# EAGLE design BUZZI-45-4 (EAGLE 5.09)
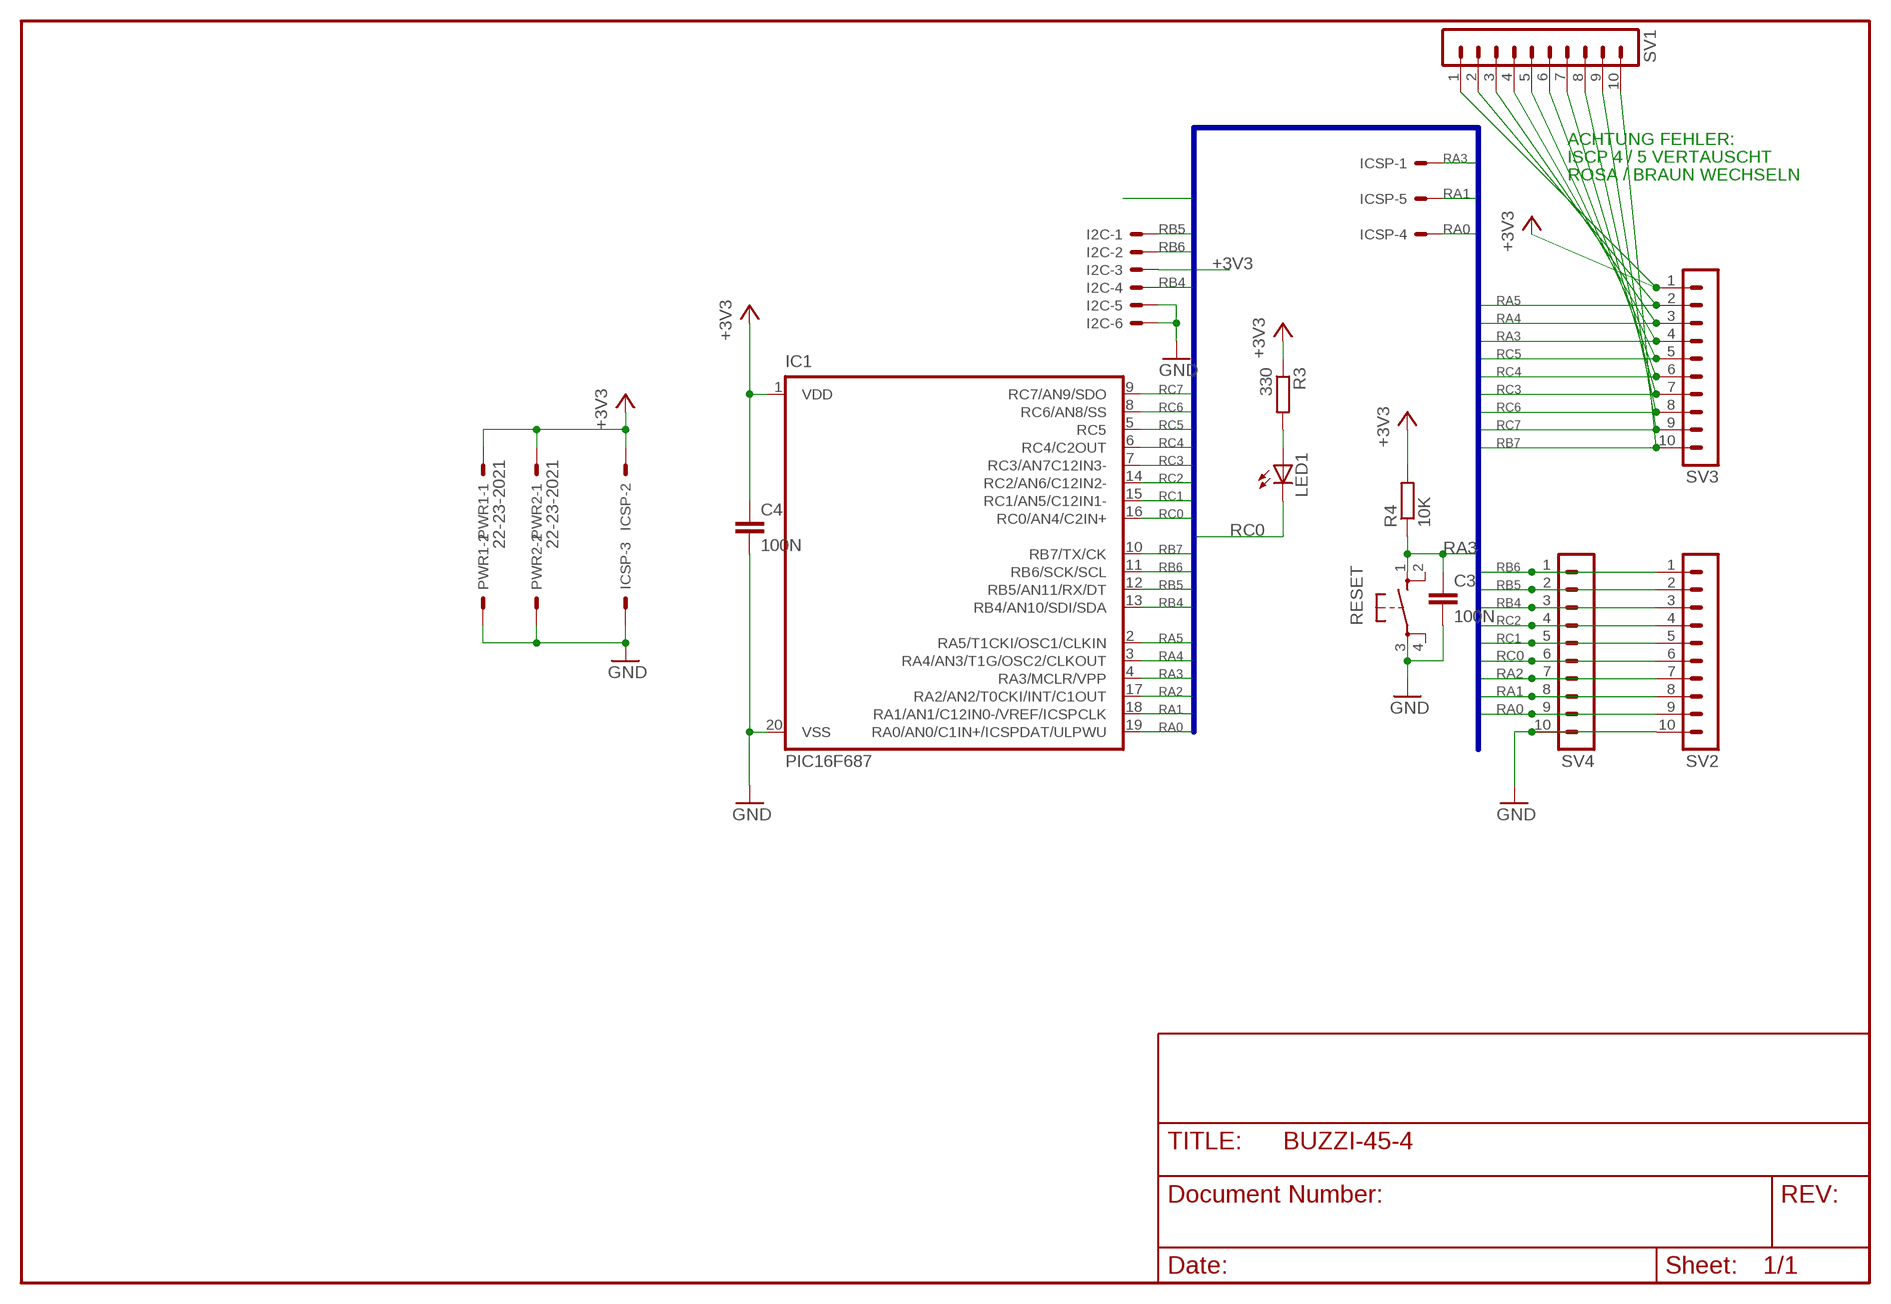
[diagram p0: schematic, sheet 1]

## Parts
C3  100N  C-EUC0805  [C0805]
C4  100N  C-EUC0805  [C0805]
I2C  22-23-2061  [22-23-2061]
IC1  PIC16F687  [SSOP20]
ICSP  22-23-2061  [22-23-2061]
LED1  LEDCHIP-LED0805  [CHIP-LED0805]
PWR1  22-23-2021  [22-23-2021]
PWR2  22-23-2021  [22-23-2021]
R3  330  R-EU_M0805  [M0805]
R4  10K  R-EU_M0805  [M0805]
RESET  10XX  [B3F-10XX]
SV1  MA10-1  [MA10-1]
SV2  MA10-1  [MA10-1]
SV3  MA10-1  [MA10-1]
SV4  MA10-1  [MA10-1]

## Nets
+3V3: C4.1 I2C.3 IC1.1(VDD) ICSP.2 PWR1.1 PWR2.1 R3.1 R4.2 SV1.1 SV3.1
GND: C3.2 C4.2 I2C.5 I2C.6 IC1.20(VSS) ICSP.3 PWR1.2 PWR2.2 RESET.3 SV2.10 SV4.10
N$1: LED1.A R3.2
RA0: IC1.19(RA0/AN0/C1IN+/ICSPDAT/ULPWU) ICSP.4 SV2.9 SV4.9
RA1: IC1.18(RA1/AN1/C12IN0-/VREF/ICSPCLK) ICSP.5 SV2.8 SV4.8
RA2: IC1.17(RA2/AN2/T0CKI/INT/C1OUT) SV2.7 SV4.7
RA3: C3.1 IC1.4(RA3/MCLR/VPP) ICSP.1 R4.1 RESET.1 SV1.4 SV3.4
RA4: IC1.3(RA4/AN3/T1G/OSC2/CLKOUT) SV1.3 SV3.3
RA5: IC1.2(RA5/T1CKI/OSC1/CLKIN) SV1.2 SV3.2
RB4: I2C.4 IC1.13(RB4/AN10/SDI/SDA) SV2.3 SV4.3
RB5: I2C.1 IC1.12(RB5/AN11/RX/DT) SV2.2 SV4.2
RB6: I2C.2 IC1.11(RB6/SCK/SCL) SV2.1 SV4.1
RB7: IC1.10(RB7/TX/CK) SV1.10 SV3.10
RC0: IC1.16(RC0/AN4/C2IN+) LED1.C SV2.6 SV4.6
RC1: IC1.15(RC1/AN5/C12IN1-) SV2.5 SV4.5
RC2: IC1.14(RC2/AN6/C12IN2-) SV2.4 SV4.4
RC3: IC1.7(RC3/AN7C12IN3-) SV1.7 SV3.7
RC4: IC1.6(RC4/C2OUT) SV1.6 SV3.6
RC5: IC1.5(RC5) SV1.5 SV3.5
RC6: IC1.8(RC6/AN8/SS) SV1.8 SV3.8
RC7: IC1.9(RC7/AN9/SDO) SV1.9 SV3.9
Unconnected: ICSP.6 RESET.2 RESET.4

## Buses
RA[0..5],RB[4..7],RC[0..7]

## Notes on the sheet
- ACHTUNG FEHLER:
- ISCP 4 / 5 VERTAUSCHT
- ROSA / BRAUN WECHSELN

## Library data of the parts
C3 C4 = turbod3:C-EU: CAPACITOR, European symbol
I2C ICSP = con-molex:22-23-2061: .100" (2.54mm) Center Header - 6 Pin
IC1 = microchip-5:PIC16F687*: MICROCONTROLLER PIC16F687 18 I/O One 16-bit timer One 8-bit timer Two comparators Precision internal oscillator-software selectable 8 MHz - 32 KHz SSP w/ I2C Compatible Address mask option EUSART LIN 2.0 Compatible 12 A/D Channels ULPW Enhanced Low Power Timer 1 Timer 1 Gate Synch Latch 2k Program Flash memory 128 bytes SRAM 256 bytes EEPROM
LED1 = led:LED: LED OSRAM: - CHIPLED LG R971, LG N971, LY N971, LG Q971, LY Q971, LO R971, LY R971 LH N974, LH R974 LS Q976, LO Q976, LY Q976 LO Q996 - Hyper CHIPLED LW Q18S LB Q993, LB Q99A, LB R99A - SideLED LS A670, LO A670, LY A670, LG A670, LP A670 LB A673, LV A673, LT A673, LW A673 LH A674 LY A675 LS A676, LA A676, LO A676, LY A676, LW A676 LS A679, LY A679, LG A679 - Hyper Micro SIDELED® LS Y876, LA Y876, LO Y876, LY Y876 LT Y87S - SmartLED LW L88C, LW L88S LB L89C, LB L89S, LG L890 LS L89K, LO L89K, LY L89K LS L896, LA L896, LO L896, LY L896 - TOPLED LS T670, LO T670, LY T670, LG T670, LP T670 LSG T670, LSP T670, LSY T670, LOP T670, LYG T670 LG T671, LOG T671, LSG T671 LB T673, LV T673, LT T673, LW T673 LH T674 LS T676, LA T676, LO T676, LY T676, LB T676, LH T676, LSB T676, LW T676 LB T67C, LV T67C, LT T67C, LS T67K, LO T67K, LY T67K, LW E67C LS E67B, LA E67B, LO E67B, LY E67B, LB E67C, LV E67C, LT E67C LW T67C LS T679, LY T679, LG T679 LS T770, LO T770, LY T770, LG T770, LP T770 LB T773, LV T773, LT T773, LW T773 LH T774 LS E675, LA E675, LY E675, LS T675 LS T776, LA T776, LO T776, LY T776, LB T776 LHGB T686 LT T68C, LB T68C - Hyper Mini TOPLED® LB M676 - Mini TOPLED Santana® LG M470 LS M47K, LO M47K, LY M47K Source: http://www.osram.convergy.de/
PWR1 PWR2 = con-molex:22-23-2021: .100" (2.54mm) Center Header - 2 Pin
R3 R4 = turbod3:R-EU_: RESISTOR, European symbol
RESET = KEY_B:10XX
SV1-SV4 = con-lstb:MA10-1: PIN HEADER

## Board
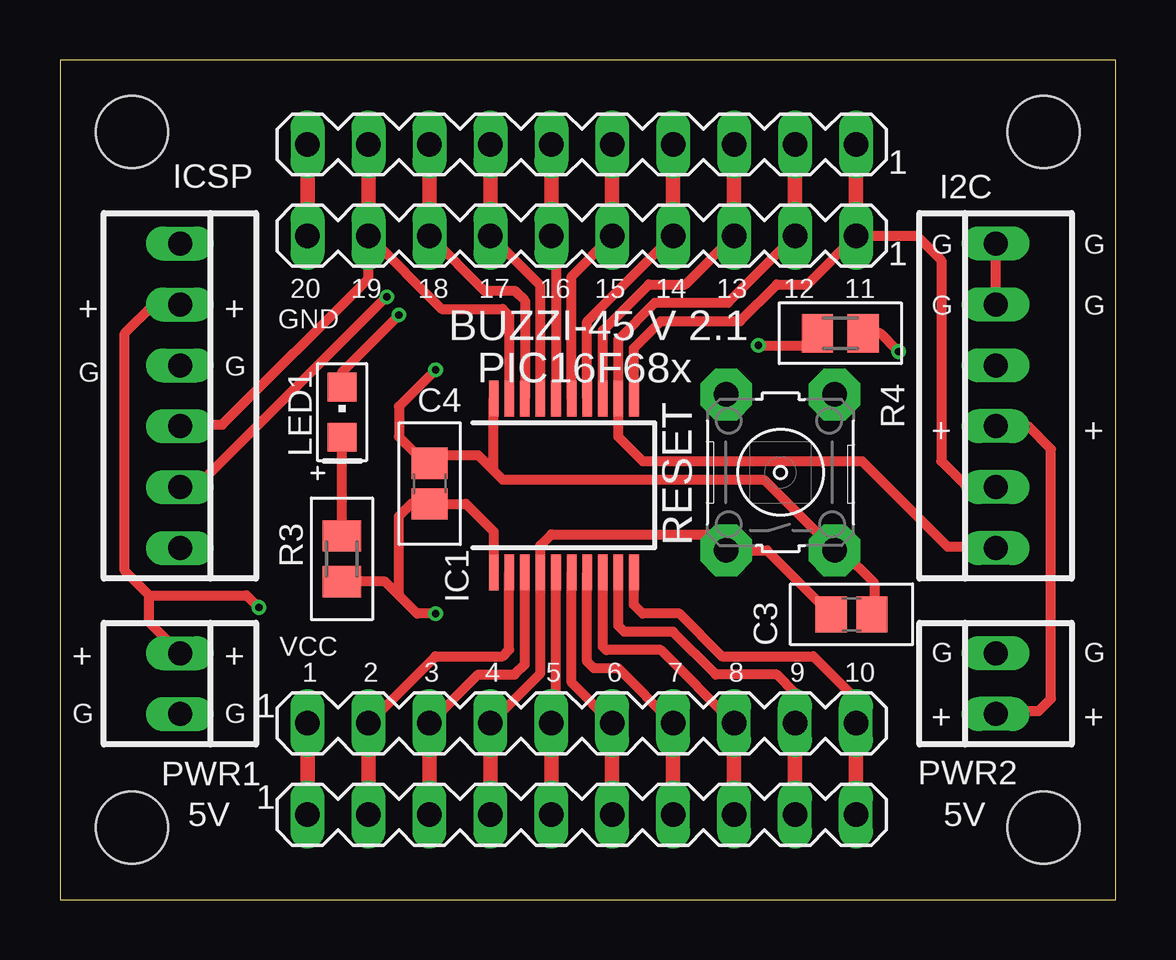
[diagram p1: board, top side]
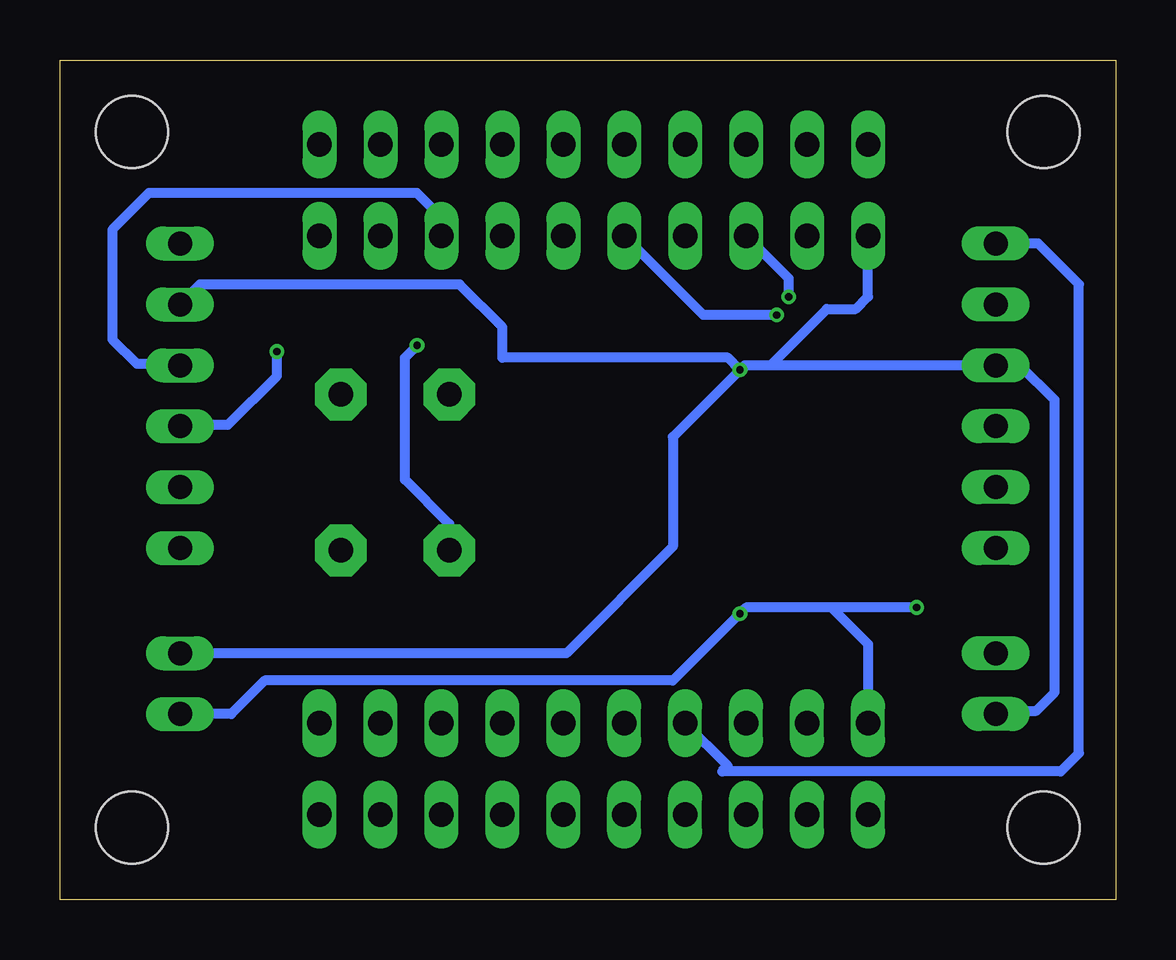
[diagram p2: board, bottom side, seen from below]

Size 44 x 35 mm. Coordinates in mm from the lower left corner, seen from the top.
Outline: 0,0 44,0 44,35 0,35 0,0
Copper layers (1*16): Top 0.035mm / dielectric 1.5mm / Bottom 0.035mm
Design rules "PCB-POOL": minimum track width 6mil, minimum drill 12mil, track to track 6mil, track to pad 6mil, pad to pad 6mil, via to via 6mil, smd to smd 6mil, copper to edge 20mil, drill to drill 8mil, minimum pad ring 8mil, minimum via ring 6mil, stop-mask expansion 3mil, vias tented up to drill 0mil, thermal gap 8mil
Holes 3 mm at 3,32 3,3 41,32 41,3

### Footprints (pad centres in the part's own frame; a part is rotated, then mirrored left to right if it is on the bottom)
C0805 = smd 1.3 x 1.5: 1 -0.85,0; 2 0.85,0
22-23-2061 = drill 1 long: 1 -6.35,0; 2 -3.81,0; 3 -1.27,0; 4 1.27,0; 5 3.81,0; 6 6.35,0
SSOP20 = smd 0.4 x 1.5: 1 -2.925,-3.625; 2 -2.275,-3.625; 3 -1.625,-3.625; 4 -0.975,-3.625; 5 -0.325,-3.625; 6 0.325,-3.625; 7 0.975,-3.625; 8 1.625,-3.625; 9 2.275,-3.625; 10 2.925,-3.625; 11 2.925,3.625; 12 2.275,3.625; 13 1.625,3.625; 14 0.975,3.625; 15 0.325,3.625; 16 -0.325,3.625; 17 -0.975,3.625; 18 -1.625,3.625; 19 -2.275,3.625; 20 -2.925,3.625
CHIP-LED0805 = smd 1.2 x 1.2: A 0,-1.05; C 0,1.05
22-23-2021 = drill 1 long: 1 -1.27,0; 2 1.27,0
M0805 = smd 1.3 x 1.6: 1 -0.95,0; 2 0.95,0
B3F-10XX = drill 1.016 pad 2.159 octagon: 1 -3.379,2.312; 2 3.123,2.312; 3 -3.379,-2.209; 4 3.123,-2.209
MA10-1 = drill 1.016 long: 1 -11.43,0; 2 -8.89,0; 3 -6.35,0; 4 -3.81,0; 5 -1.27,0; 6 1.27,0; 7 3.81,0; 8 6.35,0; 9 8.89,0; 10 11.43,0

### Placement (x,y rotation side)
C3  32.99,11.89 0 top
C4  15.41,17.34 90 top
I2C  39,21 90 top
IC1  21,17.27 0 top
ICSP  5,21 270 top
LED1  11.76,20.32 0 top
PWR1  5,9 270 top
PWR2  39,9 90 top
R3  11.76,14.2 90 top
R4  32.53,23.61 0 top
RESET  30.09,17.93 90 top
SV1  21.75,7.35 0 top
SV2  21.75,27.67 180 top
SV3  21.75,3.54 0 top
SV4  21.75,31.48 180 top

### Tracks (layer width: path | path; a pad name or v marks a point on that pad's centre or on a via)
+3V3  (via drill 0.3)
  Top 0.406: I2C.3 40.36,19.73 41.31,18.78 41.31,8.37 40.8,7.86 39.13,7.86 PWR2.1 | C4.1 15.4,16.47 | ICSP.2 3.9,24.81 2.7,23.61 2.7,13.7 3.72,12.68 | 3.72,12.68 7.78,12.68 v8.29,12.18 | v15.65,11.92 14.89,11.92 14.13,12.68 | 14.13,12.68 14.13,15.99 14.64,16.49 C4.1 | IC1.1 18.07,15.34 16.92,16.49 15.42,16.49 C4.1 | R3.1 13.56,13.25 14.13,12.68 | R4.2 34.2,23.61 v34.96,22.84 | 3.72,12.68 3.72,11.55 PWR1.1
  Top 0.61: SV1.1 SV3.1
  Bottom 0.406: PWR2.1 36.86,7.73 35.47,9.13 18.45,9.13 v15.65,11.92 15.4,12.18 11.84,12.18 | v8.29,12.18 11.84,12.18 | SV1.1 10.32,10.65 11.84,12.18 | v34.96,22.84 34.96,21.83 36.99,19.8 38.93,19.8 I2C.3
GND  (via drill 0.3)
  Top 0.406: 18.07,17.88 IC1.20 | 18.07,17.88 18.45,17.51 29.34,17.51 RESET.3 32.58,14.55 33.94,13.19 33.94,11.99 C3.2 | 38.93,24.88 I2C.5 I2C.6 | v15.65,22.08 14.13,20.56 14.13,19.29 15.23,18.19 C4.2 15.75,18.53 17.43,18.53 18.07,17.88
  Top 0.61: SV2.10 SV4.10
  Bottom 0.406: SV2.10 10.32,25.13 10.83,24.62 12.03,24.62 14.38,22.27 | v15.65,22.08 16.16,22.59 25.56,22.59 25.56,23.86 27.34,25.64 38.17,25.64 I2C.5 | PWR2.2 22.89,10.27 18.45,14.72 18.45,19.29 v15.65,22.08 | 14.38,22.27 ICSP.3 3.98,22.27 2.54,20.83 2.54,8.64 3.3,7.87 4.86,7.87 PWR1.2 | 14.38,22.27 15.47,22.27 v15.65,22.08
N$1
  Top 0.406: LED1.A R3.2
RA0
  Top 0.406: IC1.19 18.73,24.34 18.7,24.37 18.45,24.62 15.91,24.62 SV2.9 12.86,25.89 6.76,19.8 5.07,19.8 ICSP.4
  Top 0.61: SV2.9 SV4.9
RA1  (via drill 0.3)
  Top 0.406: IC1.18 19.38,24.96 18.96,25.38 17.69,25.38 SV2.8 | ICSP.5 5.68,17.19 v13.62,25.13
  Top 0.61: SV2.8 SV4.8
  Bottom 0.406: v13.62,25.13 13.62,25.89 SV2.8
RA2
  Top 0.406: IC1.17 20.02,25.59 SV2.7
  Top 0.61: SV2.7 SV4.7
RA3  (via drill 0.3)
  Top 0.406: SV1.4 20.02,9.44 IC1.4 20.02,14.77 20.48,15.22 27.11,15.22 RESET.1 29.48,14.55 C3.1 | v29.12,23.1 31.07,23.1 R4.1
  Top 0.61: SV1.4 SV3.4
  Bottom 0.406: RESET.1 27.77,15.66 29.62,17.51 29.62,22.59 v29.12,23.1 | SV1.4 16.16,5.57 16.4,5.33 2.29,5.33 1.52,6.1 1.52,25.65 3.22,27.35 ICSP.1
RA4
  Top 0.406: IC1.3 19.38,9.8 18.96,9.38 17.43,9.38 SV1.3
  Top 0.61: SV3.3 SV1.3
RA5
  Top 0.406: IC1.2 18.73,10.42 18.45,10.14 15.65,10.14 SV1.2
  Top 0.61: SV3.2 SV1.2
RB4
  Top 0.406: IC1.13 22.62,23.72 24.54,25.64 26.07,25.64 SV2.3
  Top 0.61: SV2.3 SV4.3
  Bottom 0.406: SV2.3 28.1,28.43 29.12,29.45 40.29,29.45 41.82,27.92 41.82,23.35 40.8,22.34 39.07,22.34 I2C.4
RB5
  Top 0.406: SV2.2 27.85,24.88 24.8,24.88 23.27,23.35 IC1.12 23.27,19.29 24.29,18.27 33.43,18.27 36.99,14.72 38.93,14.72 I2C.1
  Top 0.61: SV2.2 SV4.2
RB6
  Top 0.406: IC1.11 23.93,22.99 25.05,24.11 28.35,24.11 29.88,25.64 31.15,25.64 SV2.1 35.72,27.67 36.74,26.65 36.74,18.27 37.75,17.26 38.93,17.26 | 38.93,17.26 I2C.2 38.93,17.26
  Top 0.61: SV2.1 SV4.1
RB7
  Top 0.406: IC1.10 23.93,12.29 24.29,11.92 25.81,11.92 27.59,10.14 31.4,10.14 32.93,8.62 32.93,7.6 SV1.10
  Top 0.61: SV1.10 SV3.10
RC0  (via drill 0.3)
  Top 0.406: IC1.16 20.68,27.48 SV2.6 | LED1.C 11.76,22 v14.13,24.37
  Top 0.61: SV2.6 SV4.6
  Bottom 0.406: v14.13,24.37 17.18,24.37 SV2.6
RC1
  Top 0.406: IC1.15 21.32,25.98 SV2.5
  Top 0.61: SV2.5 SV4.5
RC2
  Top 0.406: IC1.14 21.98,24.09 SV2.4
  Top 0.61: SV2.4 SV4.4
RC3
  Top 0.406: IC1.7 21.98,9.92 22.26,9.64 23.27,9.64 SV1.7
  Top 0.61: SV3.7 SV1.7
RC4
  Top 0.406: IC1.6 21.32,9.04 SV1.6
  Top 0.61: SV3.6 SV1.6
RC5
  Top 0.406: IC1.5 20.68,7.54 SV1.5
  Top 0.61: SV3.5 SV1.5
RC6
  Top 0.406: IC1.8 22.62,10.54 22.77,10.4 25.05,10.4 SV1.8
  Top 0.61: SV3.8 SV1.8
RC7
  Top 0.406: IC1.9 23.27,11.41 23.53,11.16 25.56,11.16 27.34,9.38 29.88,9.38 30.64,8.62 30.64,6.84
  Top 0.61: SV3.9 30.64,6.84 SV1.9

### Text on the board
tNames: G | G | 20 | 19 | 18 | 17 | 16 | 15 | 14 | 13 | 12 | 11 | + | + | GND | G | G | BUZZI-45 V 2.1 | G | G | PIC16F68x | + | + | + | + | VCC | G | G | 1 | 2 | 3 | 4 | 5 | 6 | 7 | 8 | 9 | 10 | G | G | + | + | 5V | 5V